# EAGLE design Audio_Tianfeng2 (EAGLE 9.1.3)
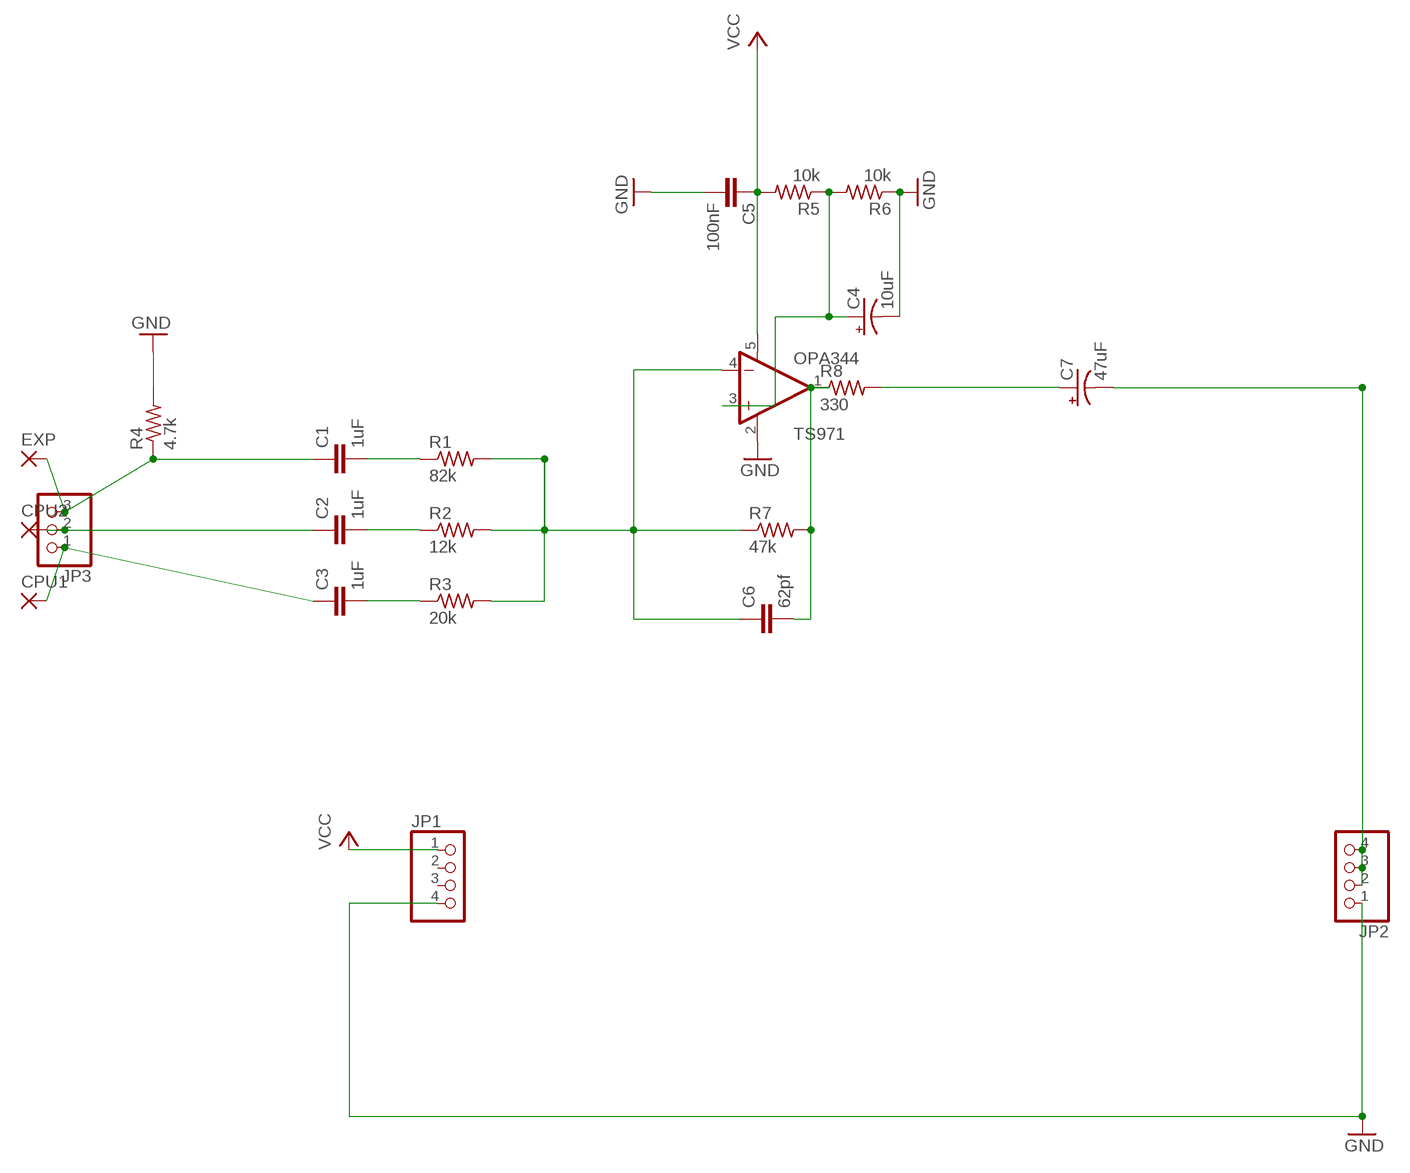
[diagram p0: schematic, sheet 1]

## Parts
C1  1uF  C-EUC0603K  [C0603K]
C2  1uF  C-EUC0603K  [C0603K]
C3  1uF  C-EUC0603K  [C0603K]
C4  10uF  CPOL-US153CLV-0405  [153CLV-0405]
C5  100nF  C-EUC0603K  [C0603K]
C6  62pf  C-EUC0603K  [C0603K]
C7  47uF  CPOL-US153CLV-0405  [153CLV-0405]
CPU1  SMD2  [SMD1,27-2,54]
CPU2  SMD2  [SMD1,27-2,54]
EXP  SMD2  [SMD1,27-2,54]
JP1  PINHD-1X04_2.54-S  [1X04-S]
JP2  PINHD-1X04_2.54-S  [1X04-S]
JP3  PINHD-1X03_2.54-S  [1X03-S]
R1  82k  R-US_R0603  [R0603]
R2  12k  R-US_R0603  [R0603]
R3  20k  R-US_R0603  [R0603]
R4  4.7k  R-US_R0603  [R0603]
R5  10k  R-US_R0603  [R0603]
R6  10k  R-US_R0603  [R0603]
R7  47k  R-US_R0603  [R0603]
R8  330  R-US_R0603  [R0603]
TS971  OPA344  [SOT23-5]

## Nets
GND: C4.- C5.2 JP1.4 JP2.1 R4.2 R6.1 TS971.2(V-)
N$1: C1.2 R1.1
N$2: C2.2 R2.1
N$3: C4.+ R5.1 R6.2 TS971.3(+IN)
N$4: C7.- JP2.2 JP2.3 JP2.4
N$5: C3.2 R3.1
N$6: C6.1 R1.2 R2.2 R3.2 R7.1 TS971.4(-IN)
N$7: C1.1 EXP.1(P) JP3.3 R4.1
N$8: C2.1 CPU2.1(P) JP3.2
N$9: C3.1 CPU1.1(P) JP3.1
N$10: C6.2 R7.2 R8.1 TS971.1(OUT)
N$11: C7.+ R8.2
VCC: C5.1 JP1.1 R5.2 TS971.5(V+)
Unconnected: JP1.2 JP1.3

## Library data of the parts
C1-C3 C5 C6 = resistor:C-EU: CAPACITOR, European symbol
C4 C7 = resistor:CPOL-US: POLARIZED CAPACITOR, American symbol
CPU1 CPU2 EXP = wirepad:SMD2: SMD PAD
JP1 JP2 = pinhead-2:PINHD-1X04: PIN HEADER
JP3 = pinhead-2:PINHD-1X03: PIN HEADER
R1-R8 = resistor:R-US_: RESISTOR, American symbol
TS971 = SparkFun-AnalogIC:OPA344: Single gate rail-to-rail output op-amp. Inputs extend 300mV past rails.; PROD_ID: IC-08251

## Board
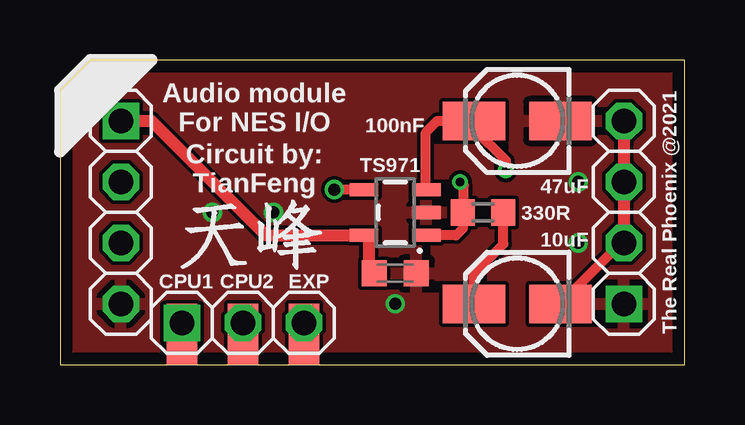
[diagram p1: board, top side]
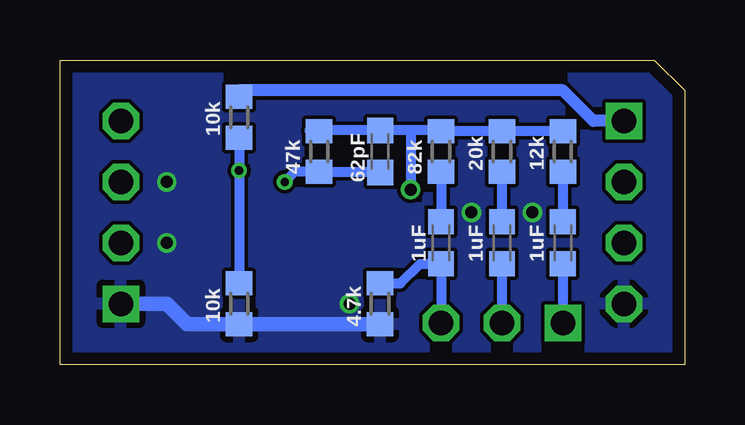
[diagram p2: board, bottom side, seen from below]

Size 26.04 x 12.7 mm. Coordinates in mm from the lower left corner, seen from the top.
Outline: 0,0 26.04,0 26.04,12.7 1.27,12.7 0,11.43 0,0
Copper layers (1*16): Top 0.035mm / dielectric 1.6mm / Bottom 0.035mm
Design rules "Elecrow_2-layer_PCB_eagle_rule": minimum track width 6mil, minimum drill 12mil, track to track 6mil, track to pad 6mil, pad to pad 6mil, via to via 8mil, smd to smd 0mil, copper to edge 20mil, drill to drill 10mil, minimum pad ring 6mil, minimum via ring 6mil, stop-mask expansion 0mil, vias tented up to drill 100mil, thermal gap 10mil

### Footprints (pad centres in the part's own frame; a part is rotated, then mirrored left to right if it is on the bottom)
C0603K = smd 1.05 x 1.08: 1 -0.875,0; 2 0.875,0
153CLV-0405 = smd 2.6 x 1.6: + 1.8,0; - -1.8,0
SMD1,27-2,54 = smd 1.27 x 2.54: 1 0,0
1X04-S = drill 1.016 square: 1 -3.81,0 | drill 1.016 octagon: 2 -1.27,0; 3 1.27,0; 4 3.81,0
1X03-S = drill 1.016 square: 1 -2.54,0 | drill 1.016 octagon: 2 0,0; 3 2.54,0
R0603 = smd 1 x 1.1: 1 -0.85,0; 2 0.85,0
SOT23-5 = smd 0.55 x 1.2: 1 -0.95,-1.3; 2 0,-1.3; 3 0.95,-1.3; 4 0.95,1.3; 5 -0.95,1.3

### Placement (x,y rotation side)
C1  10.16,5.08 90 bottom
C2  7.62,5.08 90 bottom
C3  5.08,5.08 90 bottom
C4  19.05,10.16 180 top
C5  13.97,3.81 0 top
C6  12.7,8.89 270 bottom
C7  19.05,2.54 180 top
CPU1  5.08,1.27 180 top
CPU2  7.62,1.27 180 top
EXP  10.16,1.27 180 top
JP1  2.54,6.35 270 top
JP2  23.5,6.35 90 top
JP3  7.62,1.75 0 top
R1  10.16,8.89 90 bottom
R2  7.62,8.89 90 bottom
R3  5.08,8.89 90 bottom
R4  12.7,2.54 270 bottom
R5  18.57,10.32 90 bottom
R6  18.57,2.54 90 bottom
R7  15.24,8.89 270 bottom
R8  17.62,6.35 0 top
TS971  13.97,6.35 90 top

### Tracks (layer width: path | path; a pad name or v marks a point on that pad's centre or on a via)
GND  (via drill 0.5)
  Bottom 0.61: R4.2 R6.1 20.74,1.69 21.59,2.54 JP2.1
  other vias: 6.35,6.35 8.89,6.35 21.59,5.08 21.59,7.62 13.97,2.54
  pour Top: -1.27,12.7 26.67,12.7 26.67,0 -1.27,0
  pour Bottom: -1.27,12.7 26.67,12.7 26.67,0 -1.27,0
N$1
  Bottom 0.406: R1.1 C1.2
N$2
  Bottom 0.406: R2.1 C2.2
N$3  (via drill 0.35)
  Top 0.406: TS971.3 15.24,7.33 15.24,9.68 15.72,10.16 C4.+ 17.25,9.84 18.57,8.52 v18.57,8.1
  Bottom 0.406: R5.1 v18.57,8.1 R6.2
N$4
  Top 0.406: C7.- 23.39,5.08 JP2.2
  Top 0.508: JP2.4 JP2.3 JP2.2
N$5
  Bottom 0.406: R3.1 C3.2
N$6  (via drill 0.5)
  Top 0.406: TS971.4 v11.43,7.3
  Bottom 0.406: R3.2 R2.2 R1.2 10.18,9.77 11.43,9.77 | 11.43,9.77 C6.1 15.21,9.77 | 15.21,9.77 R7.1 | 15.64,9.77 15.21,9.77 | 11.43,9.77 v11.43,7.3
N$7
  Top 0.508: EXP.1 JP3.3
  Bottom 0.406: JP3.3 C1.1 11.04,4.2 11.85,3.39 R4.1
N$8
  Top 0.508: CPU2.1 JP3.2
  Bottom 0.406: C2.1 JP3.2
N$9
  Top 0.508: CPU1.1 JP3.1
  Bottom 0.406: C3.1 JP3.1
N$10  (via drill 0.35)
  Top 0.406: TS971.1 16.51,5.4 16.77,5.66 R8.1 16.83,6.41 16.83,7.46 v16.67,7.62
  Bottom 0.406: 15.21,8.02 R7.2 | R7.2 16.25,8.04 v16.67,7.62 | R7.2 12.84,8.04 12.78,8.1
  Bottom 0.508: 12.78,8.1 C6.2 | 15.18,8.1 R7.2
N$11
  Top 0.406: R8.2 18.47,5.03 17.25,3.81 C7.+
VCC
  Top 0.508: JP1.1 3.81,10.16 8.57,5.4 TS971.5 12.86,5.21 12.86,4.05 C5.1
  Bottom 0.508: JP1.1 3.81,10.16 5.08,11.43 18.57,11.43 R5.2

### Text on the board
tNames: Audio module / For NES I/O | Circuit by: / TianFeng | 100nF | 47uF | 330R | The Real Phoenix @2021 | 10uF
bNames: 10k | 12k | 20k | 82k | 47k | 62pF | 1uF | 1uF | 1uF | 10k | 4.7k